# EAGLE design sb4 (EAGLE 9.4.0)
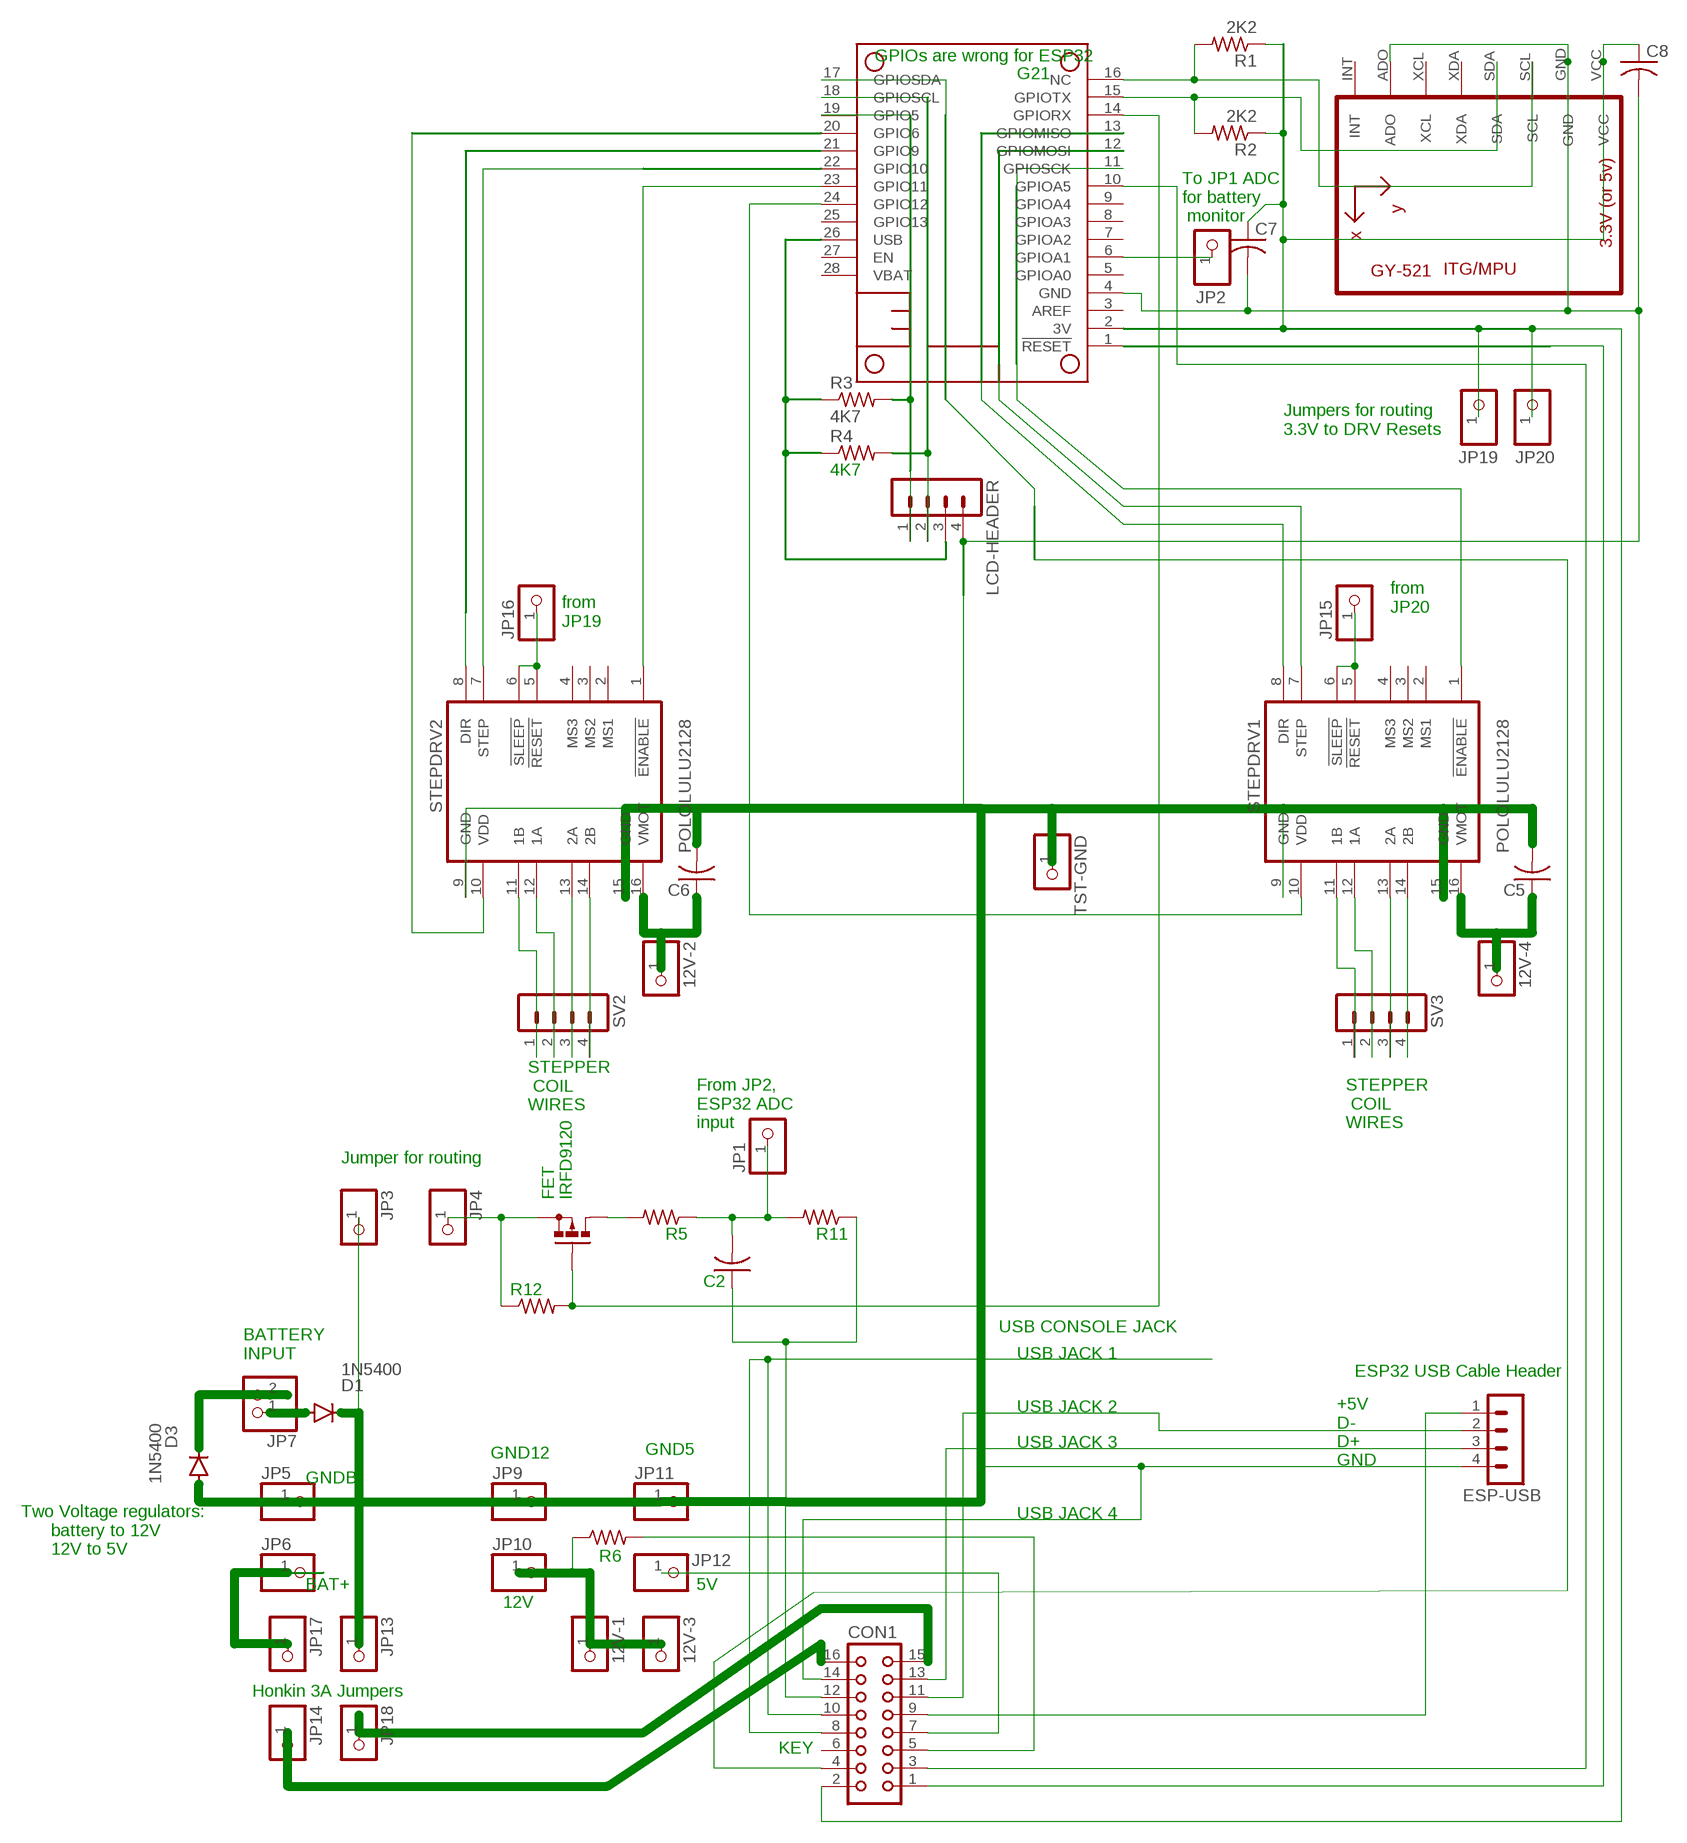
[diagram p0: schematic, sheet 1]

## Parts
12V-1  PINHD-1X1  [1X01]
12V-2  PINHD-1X1  [1X01]
12V-3  PINHD-1X1  [1X01]
12V-4  PINHD-1X1  [1X01]
C2  C-US050-025X075  [C050-025X075]
C5  C-US050-024X044  [C050-024X044]
C6  C-US050-024X044  [C050-024X044]
C7  C-US050-024X044  [C050-024X044]
C8  C-US050-024X044  [C050-024X044]
CON1  CON16  [CON16]
D1  1N5400  [DO201-15]
D3  1N5400  [DO201-15]
ESP-USB  MA04-1  [MA04-1]
FET  IRFD9120  [C370-01]
JP1  PINHD-1X1  [1X01]
JP2  PINHD-1X1  [1X01]
JP3  PINHD-1X1  [1X01]
JP4  PINHD-1X1  [1X01]
JP5  PINHD-1X1  [1X01]
JP6  PINHD-1X1  [1X01]
JP7  PINHD-1X2  [1X02]
JP9  PINHD-1X1  [1X01]
JP10  PINHD-1X1  [1X01]
JP11  PINHD-1X1  [1X01]
JP12  PINHD-1X1  [1X01]
JP13  PINHD-1X1  [1X01]
JP14  PINHD-1X1  [1X01]
JP15  PINHD-1X1  [1X01]
JP16  PINHD-1X1  [1X01]
JP17  PINHD-1X1  [1X01]
JP18  PINHD-1X1  [1X01]
JP19  PINHD-1X1  [1X01]
JP20  PINHD-1X1  [1X01]
LCD-HEADER  MA04-1  [MA04-1]
MS2  FEATHERWING_NOHOLES  [FEATHERWING_NOHOLES]
R1  2K2  R-US_0309/12  [0309/12]
R2  2K2  R-US_0309/12  [0309/12]
R3  4K7  R-US_0309/12  [0309/12]
R4  4K7  R-US_0309/12  [0309/12]
R5  R-US_0207/10  [0207/10]
R6  R-US_0207/10  [0207/10]
R11  R-US_0207/10  [0207/10]
R12  R-US_0207/10  [0207/10]
STEPDRV1  POLOLULU2128  [POLOLULU2128]
STEPDRV2  POLOLULU2128  [POLOLULU2128]
SV2  MA04-1  [MA04-1]
SV3  MA04-1  [MA04-1]
TST-GND  PINHD-1X1  [1X01]
U1  GY-521MPU6050  [GY-521]

## Nets
3V: C7.1 C8.1 CON1.2 JP19.1 JP20.1 MS2.2(3V) R1.1 R2.1 U1.VCC
N$1: MS2.24(GPIO12) STEPDRV1.10(VDD)
N$2: CON1.5 R6.2
N$3: MS2.13(GPIOMISO) STEPDRV1.8(DIR)
N$4: CON1.1 MS2.1(!RESET)
N$5: JP15.1 STEPDRV1.5(!RESET) STEPDRV1.6(!SLEEP)
N$6: FET.G MS2.14(GPIORX) R12.2
N$7: JP16.1 STEPDRV2.5(!RESET) STEPDRV2.6(!SLEEP)
N$8: STEPDRV2.14(2B) SV2.4
N$9: CON1.16 JP14.1
N$11: LCD-HEADER.1 MS2.19(GPIO5) R3.2
N$12: STEPDRV2.13(2A) SV2.3
N$13: STEPDRV2.12(1A) SV2.2
N$14: STEPDRV2.11(1B) SV2.1
N$15: MS2.12(GPIOMOSI) STEPDRV1.7(STEP)
N$16: STEPDRV1.14(2B) SV3.4
N$17: MS2.16(NC) R1.2 U1.SCL
N$18: STEPDRV1.13(2A) SV3.3
N$19: STEPDRV1.12(1A) SV3.2
N$20: STEPDRV1.11(1B) SV3.1
N$21: MS2.11(GPIOSCK) STEPDRV1.1(!ENABLE)
N$22: CON1.11 ESP-USB.2
N$23: CON1.13 ESP-USB.3
N$24: FET.S JP4.1 R12.1
N$25: MS2.15(GPIOTX) R2.2 U1.SDA
N$26: D1.A JP7.1
N$27: JP6.1 JP17.1
N$28: CON1.4 MS2.17(GPIOSDA)
N$29: MS2.21(GPIO9) STEPDRV2.8(DIR)
N$30: C2.2 JP1.1 R5.1 R11.2
N$31: JP2.1 MS2.6(GPIOA1)
N$32: D1.C JP3.1 JP13.1
N$33: C2.1 C5.2 C6.2 C7.2 C8.2 CON1.12 CON1.14 D3.A ESP-USB.4 JP5.1 JP9.1 JP11.1 LCD-HEADER.4 MS2.4(GND) R11.1 STEPDRV1.9(GND) STEPDRV1.15(GND) STEPDRV2.9(GND) STEPDRV2.15(GND) TST-GND.1 U1.ADO U1.GND
N$34: MS2.22(GPIO10) STEPDRV2.7(STEP)
N$35: LCD-HEADER.2 MS2.18(GPIOSCL) R4.2
N$36: MS2.20(GPIO6) STEPDRV2.10(VDD)
N$37: MS2.23(GPIO11) STEPDRV2.1(!ENABLE)
N$38: CON1.15 JP18.1
N$39: CON1.3 MS2.10(GPIOA5)
N$40: CON1.8 CON1.10
N$42: 12V-1.1 12V-3.1 JP10.1 R6.1
N$43: CON1.7 JP12.1
N$44: 12V-2.1 C6.1 STEPDRV2.16(VMOT)
N$45: 12V-4.1 C5.1 STEPDRV1.16(VMOT)
N$46: D3.C JP7.2
N$51: FET.D FET.D1(D) R5.2
N$55: CON1.9 ESP-USB.1
USB: LCD-HEADER.3 MS2.26(USB) R3.1 R4.1
Unconnected: CON1.6 MS2.3(AREF) MS2.5(GPIOA0) MS2.7(GPIOA2) MS2.8(GPIOA3) MS2.9(GPIOA4) MS2.25(GPIO13) MS2.27(EN) MS2.28(VBAT) STEPDRV1.2(MS1) STEPDRV1.3(MS2) STEPDRV1.4(MS3) STEPDRV2.2(MS1) STEPDRV2.3(MS2) STEPDRV2.4(MS3) U1.INT U1.XCL U1.XDA

## Notes on the sheet
- GPIOs are wrong for ESP32
- G21
- To JP1 ADC
  for battery
   monitor
- Jumpers for routing
  3.3V to DRV Resets
- from
  JP20
- from
  JP19
- STEPPER
   COIL
  WIRES
- From JP2,
  ESP32 ADC
  input
- STEPPER
   COIL
  WIRES
- Jumper for routing
- USB CONSOLE JACK
- BATTERY
  INPUT
- USB JACK 1
- ESP32 USB Cable Header
- USB JACK 2
- USB JACK 3
- GND12 | GND5
- +5V
  D-
  D+
  GND
- GNDB
- USB JACK 4
- Two Voltage regulators:
        battery to 12V
        12V to 5V
- BAT+ | 5V
- 12V
- Honkin 3A Jumpers
- KEY

## Library data of the parts
12V-1-12V-4 JP1-JP6 JP9-JP20 TST-GND = pinhead:PINHD-1X1: PIN HEADER
C2 C5-C8 = rcl:C-US: CAPACITOR, American symbol; SPICEPREFIX: C
CON1 = con-harting:CON16: CONNECTOR; OC_FARNELL: unknown; OC_NEWARK: unknown
D1 D3 = diode:1N5400: DIODE standard rectifier, 3 A, 50 V (Motorola)
ESP-USB LCD-HEADER SV2 SV3 = con-lstb:MA04-1: PIN HEADER; OC_FARNELL: unknown; OC_NEWARK: unknown
FET = transistor-small-signal:IRFD9120: P-CHANNEL MOS FET
JP7 = pinhead:PINHD-1X2: PIN HEADER
MS2 = microbuilder:FEATHERWING
R1-R4 = resistor:R-US_: RESISTOR, American symbol
R5 R6 R11 R12 = rcl:R-US_: RESISTOR, American symbol; SPICEPREFIX: R
STEPDRV1 STEPDRV2 = stepper_drivers_etc:POLOLULU2128
U1 = gy-521a:GY-521

## Board
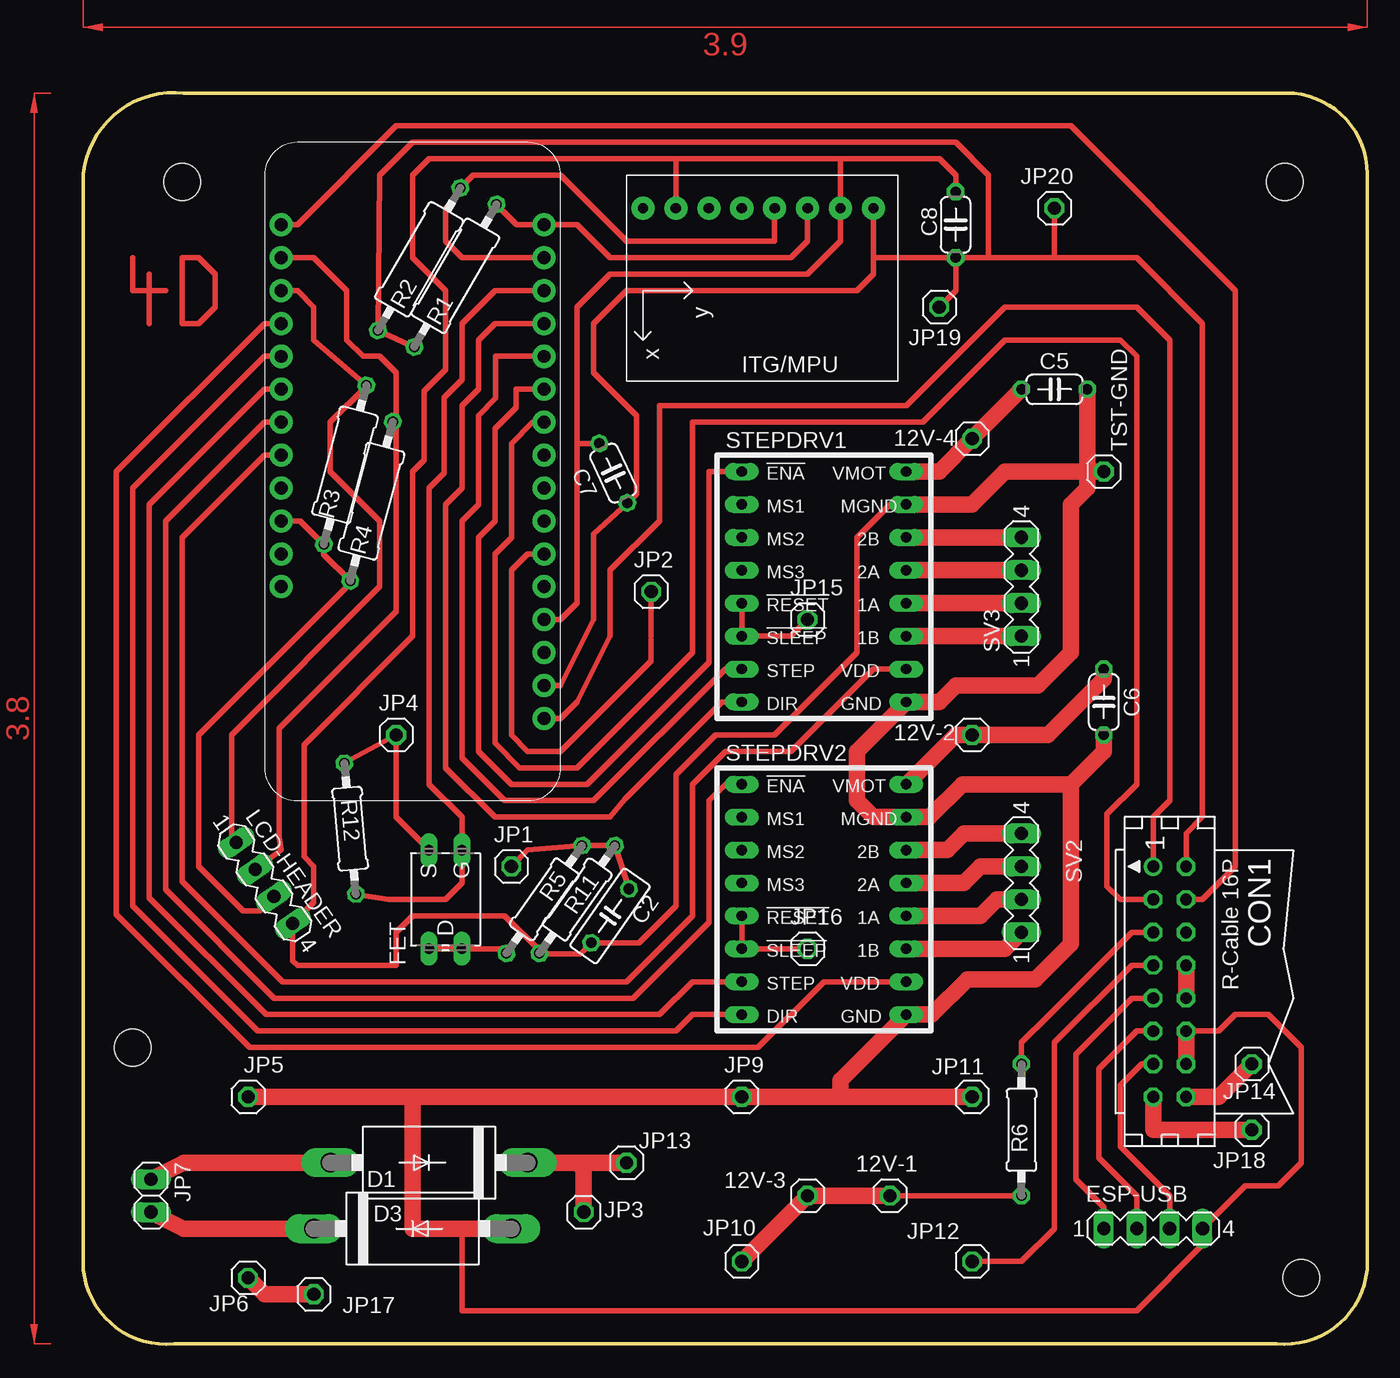
[diagram p1: board, top side]

Size 99.06 x 96.59 mm. Coordinates in mm from the lower left corner, seen from the top.
Outline: 99.06,90.33 arc90 92.84,96.55 7.75,96.55 arc90 0,90.33 0,5.75 arc90 6.99,0.03 92.08,0.03 arc90 99.06,5.75 99.06,90.33
Copper layers (1*16): Top 0.035mm / dielectric 1.5mm / Bottom 0.035mm
Design rules "default": minimum track width 6mil, minimum drill 0.35mm, track to track 6mil, track to pad 6mil, pad to pad 6mil, via to via 6mil, smd to smd 6mil, copper to edge 40mil, drill to drill 6mil, minimum pad ring 10mil, minimum via ring 8mil, stop-mask expansion 4mil, vias tented up to drill 0mil, thermal gap 10mil
Holes 2.85 mm at 92.71,89.69 3.81,22.89 7.62,89.69 93.98,5.11

### Footprints (pad centres in the part's own frame; a part is rotated, then mirrored left to right if it is on the bottom)
1X01 = drill 1.016 octagon: 1 0,0
C050-025X075 = drill 0.813 octagon: 1 -2.54,0; 2 2.54,0
C050-024X044 = drill 0.813 octagon: 1 -2.54,0; 2 2.54,0
CON16 = drill 0.914: 1 -8.89,-1.27 | drill 0.914 octagon: 2 -8.89,1.27; 3 -6.35,-1.27; 4 -6.35,1.27; 5 -3.81,-1.27; 6 -3.81,1.27; 7 -1.27,-1.27; 8 -1.27,1.27; 9 1.27,-1.27; 10 1.27,1.27; 11 3.81,-1.27; 12 3.81,1.27; 13 6.35,-1.27; 14 6.35,1.27; 15 8.89,-1.27; 16 8.89,1.27
DO201-15 = drill 1.499 long: A 7.62,0; C -7.62,0
MA04-1 = drill 1.016 long: 1 -3.81,0; 2 -1.27,0; 3 1.27,0; 4 3.81,0
C370-01 = drill 0.813 long: D -3.81,1.27; D1 -3.81,-1.27; G 3.81,-1.27; S 3.81,1.27
1X02 = drill 1.016 long: 1 -1.27,0; 2 1.27,0
FEATHERWING_NOHOLES = drill 1 pad 1.778: 1 6.35,1.27; 2 8.89,1.27; 3 11.43,1.27; 4 13.97,1.27; 5 16.51,1.27; 6 19.05,1.27; 7 21.59,1.27; 8 24.13,1.27; 9 26.67,1.27; 10 29.21,1.27; 11 31.75,1.27; 12 34.29,1.27; 13 36.83,1.27; 14 39.37,1.27; 15 41.91,1.27; 16 44.45,1.27; 17 44.45,21.59; 18 41.91,21.59; 19 39.37,21.59; 20 36.83,21.59; 21 34.29,21.59; 22 31.75,21.59; 23 29.21,21.59; 24 26.67,21.59; 25 24.13,21.59; 26 21.59,21.59; 27 19.05,21.59; 28 16.51,21.59
0309/12 = drill 0.813 octagon: 1 -6.35,0; 2 6.35,0
0207/10 = drill 0.813 octagon: 1 -5.08,0; 2 5.08,0
POLOLULU2128 = drill 0.8 long: 1 -7.62,7.62; 2 -7.62,5.08; 3 -7.62,2.54; 4 -7.62,0; 5 -7.62,-2.54; 6 -7.62,-5.08; 7 -7.62,-7.62; 8 -7.62,-10.16; 9 5.08,-10.16; 10 5.08,-7.62; 11 5.08,-5.08; 12 5.08,-2.54; 13 5.08,0; 14 5.08,2.54; 15 5.08,5.08; 16 5.08,7.62
GY-521 = drill 0.8 pad 1.778: ADO -8.89,-6.35; GND -8.89,6.35; INT -8.89,-8.89; SCL -8.89,3.81; SDA -8.89,1.27; VCC -8.89,8.89; XCL -8.89,-3.81; XDA -8.89,-1.27

### Placement (x,y rotation side)
12V-1  62.23,11.46 0 top
12V-2  68.58,47.02 0 top
12V-3  55.88,11.46 0 top
12V-4  68.58,69.88 0 top
C2  40.64,33.05 55 top
C5  74.93,73.69 0 top
C6  78.74,49.56 270 top
C7  40.89,67.21 115 top
C8  67.31,86.39 90 top
CON1  83.82,27.97 270 top
D1  26.67,14 180 top
D3  25.4,8.92 0 top
ESP-USB  82.55,8.92 0 top
FET  27.94,34.32 90 top
JP1  33.02,36.86 0 top
JP2  43.81,58.07 0 top
JP3  38.61,10.19 0 top
JP4  24.13,47.02 0 top
JP5  12.7,19.08 0 top
JP6  12.7,5.11 0 top
JP7  5.21,11.46 270 top
JP9  50.8,19.08 0 top
JP10  50.8,6.38 0 top
JP11  68.58,19.08 0 top
JP12  68.58,6.38 0 top
JP13  41.91,14 0 top
JP14  90.17,21.62 0 top
JP15  55.88,55.91 0 top
JP16  55.88,30.51 0 top
JP17  17.78,3.84 0 top
JP18  90.17,16.54 0 top
JP19  66.04,80.04 0 top
JP20  74.93,87.66 0 top
LCD-HEADER  13.97,35.59 305 top
MS2  36.83,41.94 90 top
R1  28.7,82.45 60 top
R2  25.91,83.72 60 top
R3  20.19,67.85 75 top
R4  22.23,65.06 75 top
R5  35.56,34.32 235 top
R6  72.39,16.54 90 top
R11  38.1,34.32 55 top
R12  20.57,39.78 275 top
STEPDRV1  58.42,59.72 0 top
STEPDRV2  58.42,35.59 0 top
SV2  72.39,35.59 90 top
SV3  72.39,58.45 90 top
TST-GND  78.74,67.34 0 top
U1  52.07,78.77 270 top

### Tracks (layer width: path | path; a pad name or v marks a point on that pad's centre or on a via)
3V
  Top 0.406: 69.85,83.85 69.85,90.2 67.31,92.74 25.4,92.74 22.86,90.2 R2.1 R1.1 | JP19.1 67.31,81.31 C8.1 | JP20.1 74.93,83.85 | 74.93,83.85 81.28,83.85 86.36,78.77 86.36,40.67 85.09,39.4 CON1.2 | 74.93,83.85 69.85,83.85 | MS2.2 36.83,50.83 39.37,55.91 39.37,62.51 C7.1 42.67,65.62 42.67,71.66 39.37,74.96 39.37,78.77 41.91,81.31 59.69,81.31 60.96,82.58 60.96,83.85 | U1.VCC 60.96,83.85 | 60.96,83.85 C8.1 | C8.1 69.85,83.85
N$1
  Top 0.406: MS2.24 13.97,68.61 7.62,62.26 7.62,35.72 15.37,27.97 41.91,27.97 46.99,33.05 46.99,43.21 49.53,45.75 54.61,45.75 60.96,52.1 STEPDRV1.10
N$2
  Top 0.406: CON1.5 80.9,31.78 74.49,25.37 72.39,23.27 R6.2
N$3
  Top 0.406: STEPDRV1.8 49.28,49.56 41.78,42.07 40.64,40.67 31.75,40.67 27.94,44.48 27.94,64.8 29.21,66.07 29.21,72.42 30.48,73.69 30.48,77.5 31.75,78.77 MS2.13
N$4
  Top 0.406: MS2.1 36.83,48.29 38.1,49.56 40.64,54.64 40.64,59.72 44.45,63.53 44.45,72.42 63.5,72.42 71.12,80.04 81.28,80.04 83.82,77.5 83.82,41.94 82.55,40.67 CON1.1
N$5
  Top 0.406: STEPDRV1.5 STEPDRV1.6 54.61,54.64 JP15.1
N$6
  Top 0.406: MS2.14 31.75,81.31 29.21,78.77 29.21,74.45 27.81,73.06 27.81,67.21 26.67,66.07 26.67,43.21 29.21,40.67 FET.G 29.21,35.59 27.94,34.32 23.53,34.32 R12.2
N$7
  Top 0.406: STEPDRV2.5 STEPDRV2.6 JP16.1
N$8
  Top 1.27: SV2.4 67.95,39.4 66.67,38.13 STEPDRV2.14
N$9
  Top 1.27: JP14.1 87.63,19.08 CON1.16
N$10
  Top 0.406: 3.81,83.85 3.81,81.31 5.08,81.31 | 6.35,81.31 5.08,81.31 | 5.08,82.58 5.08,81.31 | 5.08,81.31 5.08,78.77
N$11
  Top 0.406: MS2.19 16.51,81.31 17.78,80.04 17.78,77.49 R3.2 21.84,73.94 19.05,71.15 19.05,67.34 22.86,63.53 22.86,58.45 11.43,47.02 11.43,39.07 LCD-HEADER.1
N$12
  Top 1.27: SV2.3 69.22,36.86 67.95,35.59 STEPDRV2.13
N$13
  Top 1.27: SV2.2 70.48,34.32 69.22,33.05 STEPDRV2.12
N$14
  Top 1.27: SV2.1 71.12,30.51 STEPDRV2.11
N$15
  Top 0.406: STEPDRV1.7 49.53,52.1 39.37,41.94 32.51,41.94 29.21,45.24 29.21,63.53 30.48,64.8 30.48,71.66 31.81,72.99 31.81,76.23 MS2.12
N$16
  Top 1.27: STEPDRV1.14 SV3.4
N$17
  Top 0.406: U1.SCL 55.88,85.12 54.61,83.85 40.64,83.85 38.1,86.39 MS2.16 33.44,86.39 R1.2
N$18
  Top 1.27: STEPDRV1.13 SV3.3
N$19
  Top 1.27: STEPDRV1.12 SV3.2
N$20
  Top 1.27: STEPDRV1.11 SV3.1
N$21
  Top 0.406: STEPDRV1.1 48.26,67.34 48.26,52.61 38.86,43.21 33.02,43.21 30.48,45.75 30.48,62.26 31.75,63.53 31.75,70.64 33.4,72.29 33.4,73.69 MS2.11
N$22
  Top 0.406: CON1.11 81.28,24.16 78.36,21.24 78.36,14.38 81.28,11.46 ESP-USB.2
N$23
  Top 0.406: CON1.13 81.66,21.62 80.01,19.97 80.01,15.27 83.82,11.46 ESP-USB.3
N$24
  Top 0.406: FET.S 24.13,40.67 JP4.1 R12.1
N$25
  Top 0.406: MS2.15 29.21,83.85 27.94,85.12 27.94,87.66 29.08,88.8 R2.2 30.06,90.2 36.83,90.2 41.91,85.12 53.34,85.12 U1.SDA
N$26
  Top 1.27: JP7.1 7.75,14 D1.A
N$27
  Top 1.27: JP17.1 13.97,3.84 JP6.1
N$28
  Top 0.406: MS2.17 16.51,86.39 24.13,94.01 76.2,94.01 88.9,81.31 88.9,36.86 86.36,34.32 CON1.4
N$29
  Top 0.406: MS2.21 13.97,76.23 3.81,66.07 3.81,33.81 13.46,24.16 45.72,24.16 46.99,25.43 STEPDRV2.8
N$30
  Top 0.406: C2.2 R11.2 R5.1 34.29,38.13 JP1.1
N$31
  Top 0.152: 43.81,54.64 43.81,54.39
  Top 0.406: JP2.1 43.81,54.64 | 43.81,54.39 43.81,52.74 36.83,45.75 34.29,45.75 33.02,47.02 33.02,59.72 34.29,60.99 MS2.6
N$32
  Top 1.27: D1.C 38.1,14 | 38.1,14 JP13.1 | JP3.1 38.61,13.49 38.1,14
N$33
  Top 0.152: R11.1 35.22,30.13
  Top 0.406: 35.22,30.13 38.34,30.13 C2.1 42.88,30.97 45.72,33.81 45.72,43.97 48.77,47.02 53.34,47.02 59.69,53.37 59.69,62.26 62.23,64.8 STEPDRV1.15 | 58.42,91.47 66.04,91.47 67.31,90.2 C8.2 | 58.42,91.47 45.72,91.47 | 45.72,91.47 26.67,91.47 25.4,90.2 25.4,83.85 27.94,81.31 27.94,75.22 26.29,73.56 26.29,68.23 25.4,67.34 25.4,54.64 17.02,46.26 17.02,37.62 17.78,36.86 17.78,34.1 LCD-HEADER.4 | R11.1 35.19,30.38 32.51,33.05 25.4,33.05 24.13,31.78 24.13,29.24 16.51,29.24 16.16,29.6 LCD-HEADER.4 | 29.21,8.92 29.21,2.57 81.28,2.57 86.36,7.65 ESP-USB.4 89.66,12.22 92.2,12.22 93.98,14 93.98,22.89 91.44,25.43 88.9,25.43 87.63,24.16 CON1.12 | MS2.4 36.83,55.91 38.1,57.18 38.1,69.52 | C7.2 38.1,69.52 | 38.1,69.52 38.1,80.04 40.64,82.58 55.88,82.58 58.42,85.12 U1.GND 58.42,91.47 | U1.ADO 45.72,91.47 | 16.16,32.7 LCD-HEADER.4
  Top 1.27: 77.47,67.34 77.47,66.07 76.2,64.8 76.2,53.37 73.66,50.83 67.31,50.83 66.04,49.56 STEPDRV1.9 59.69,45.75 59.69,41.94 60.96,40.67 STEPDRV2.15 65.28,40.67 67.82,43.21 76.2,43.21 | STEPDRV1.15 68.58,64.8 71.12,67.34 77.47,67.34 | 25.4,19.08 25.4,8.92 29.21,8.92 D3.A | 77.47,67.34 TST-GND.1 | 76.2,43.21 76.2,30.89 73.47,28.16 68.2,28.16 65.47,25.43 STEPDRV2.9 58.42,20.35 58.42,19.08 | C6.2 78.74,45.75 76.2,43.21 | C5.2 77.47,67.34 | CON1.14 CON1.12 | 58.42,19.08 JP11.1 | JP5.1 25.4,19.08 | 25.4,19.08 JP9.1 58.42,19.08
N$34
  Top 0.406: MS2.22 13.97,73.69 5.08,64.8 5.08,34.45 14.1,25.43 44.45,25.43 46.99,27.97 STEPDRV2.7
N$35
  Top 0.406: MS2.18 17.78,83.85 20.32,81.31 20.32,77.5 21.59,76.23 22.86,76.23 24.13,74.96 24.13,71.15 | 24.13,71.15 24.09,71.19 R4.2 | 24.13,71.15 24.13,56.55 15.11,47.53 15.11,39.16 15.24,38.13 LCD-HEADER.2
N$36
  Top 0.406: MS2.20 13.97,78.77 2.54,67.34 2.54,33.18 12.83,22.89 52.07,22.89 57.15,27.97 STEPDRV2.10
N$37
  Top 0.406: MS2.23 13.97,71.15 6.35,63.53 6.35,35.08 14.73,26.7 42.42,26.7 48.26,32.54 48.26,41.94 49.53,43.21 STEPDRV2.1
N$38
  Top 1.27: CON1.15 82.55,16.54 JP18.1
N$39
  Top 0.406: CON1.3 80.01,34.32 78.99,35.34 78.99,40.93 81.28,43.21 81.28,76.23 80.01,77.5 71.12,77.5 64.77,71.15 46.99,71.15 46.99,53.37 38.1,44.48 33.66,44.48 31.75,46.39 31.75,60.99 33.02,62.26 33.02,69.5 34.67,71.15 MS2.10
N$40
  Top 1.27: CON1.10 CON1.8
N$41
  Top 0.406: 7.62,83.85 7.62,78.77 8.89,78.77 10.16,80.04 10.16,82.58 8.89,83.85 7.62,83.85
N$42
  Top 0.406: 12V-1.1 R6.1
  Top 1.27: JP10.1 12V-3.1 12V-1.1
N$43
  Top 0.406: CON1.7 80.9,29.24 74.93,23.27 74.93,8.92 72.39,6.38 JP12.1
N$44
  Top 1.27: C6.1 78.74,51.34 74.42,47.02 12V-2.1 67.31,47.02 STEPDRV2.16
N$45
  Top 1.27: STEPDRV1.16 66.04,67.34 12V-4.1 C5.1
N$46
  Top 1.27: JP7.2 7.75,8.92 D3.C
N$51
  Top 0.406: FET.D FET.D1 32.73,30.51 R5.2
N$55
  Top 0.406: CON1.9 80.9,26.7 76.58,22.38 76.58,12.73 78.74,10.57 ESP-USB.1
USB
  Top 0.406: LCD-HEADER.3 13.6,33.42 12.33,33.42 8.89,36.86 8.89,47.02 20.58,58.71 R4.1 18.55,60.95 R3.1 16.73,63.53 MS2.26
(copper drawn outside any net)
  shapes: Top area x2